# Altium schematic sheet SUP_2.5_FMC.SchDoc: AMC FMC Carrier v4
size A4; CompanyName: WUT; Organization: WUT ISE; Address1: Warsaw University of Technology; Address2: Nowowiejska 15/19 00-665 Warsaw; Address3: t.przywozki@gmail.com; Revision: 1; SheetNumber: 15; SheetTotal: 29; Project: AMC FMC Carrier v4.0.2; ModifiedBy: F. Świtakowski; CreateDate: XX/XX/XXXX; CheckedDate: -; Title2: Power FMCs PVADJ; DivGrp: ISE; Designer: T. Przywozki; ModifiedDate: -; ProjectName: ADC/DAC MEZZANINE
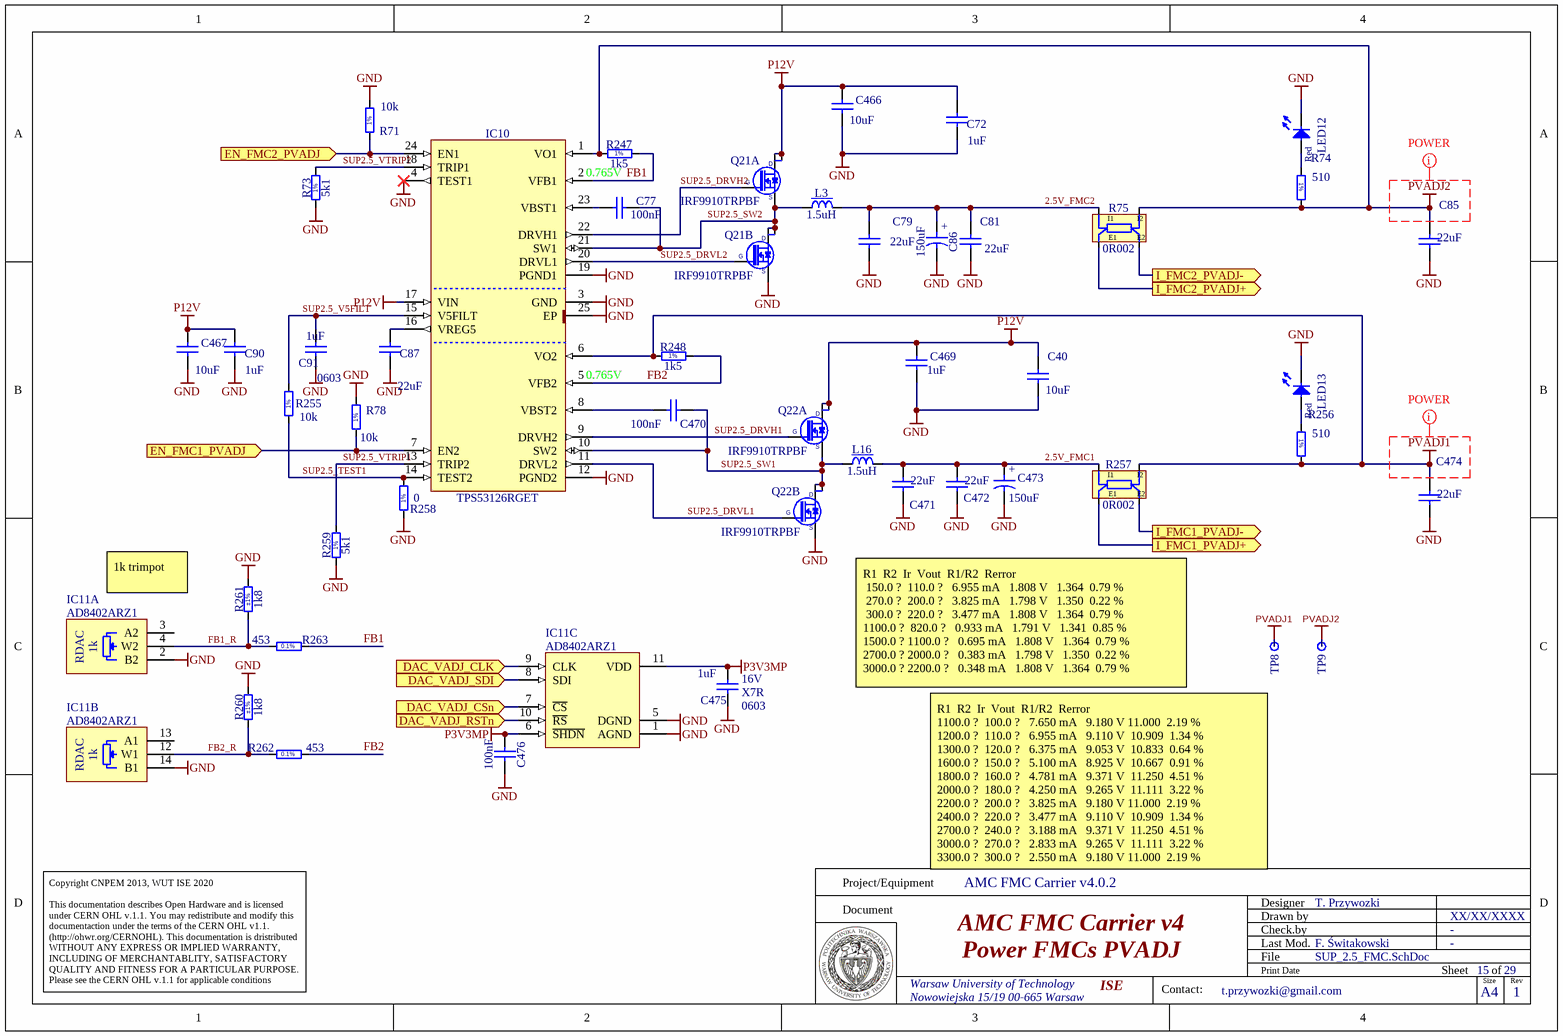
[diagram p0: SUP_2.5_FMC.SchDoc]

## Parts
C40  10uF  [CAPC2012X135N]
C72  1uF  [CAPC1608X87N]
C77  100nF  [CAPC1005X55N]
C79  22uF  [CAPC3216X180N]
C81  22uF  [CAPC3216X180N]
C85  22uF  [CAPC3216X180N]
C86  150uF  [CAPMP7343X200N]
C87  22uF  [CAPC3216X180N]
C90  1uF  [CAPC1608X87N]
C91  1uF  Case: 0603  [CAPC1608X87N]
C466  10uF  [CAPC2012X135N]
C467  10uF  [CAPC2012X135N]
C469  1uF  [CAPC1608X87N]
C470  100nF  [CAPC1005X55N]
C471  22uF  [CAPC3216X180N]
C472  22uF  [CAPC3216X180N]
C473  150uF  [CAPMP7343X200N]
C474  22uF  [CAPC3216X180N]
C475  1uF  Voltage: 16V  TC: X7R  Case: 0603  [CAPC1608X87N]
C476  100nF  [CAPC0603X33N]
IC10  TPS53126RGET  [QFN50P400X400X100-25N-S255]
IC11  AD8402ARZ1  [SOIC127P600X175-14N]  (parts A,B,C of 3)
L3  1.5uH  [IND_TDK_SPM6530]
L16  1.5uH  [IND_TDK_SPM6530]
LED12  Red  [LED_KINGBRIGHT_KPH-1608SURCK]
LED13  Red  [LED_KINGBRIGHT_KPH-1608SURCK]
Q21  IRF9910TRPBF  [SOIC127P600X175-8N]  (parts A,B of 2)
Q22  IRF9910TRPBF  [SOIC127P600X175-8N]  (parts A,B of 2)
R71  10k  [RESC1005X40N]
R73  5k1  [RESC1608X55N]
R74  510  [RESC1005X40N]
R75  0R002  [RES_VISHAY_WSK2512_0R005-0R2]
R78  10k  [RESC1005X40N]
R247  1k5  [RESC1608X55N]
R248  1k5  [RESC1608X55N]
R255  10k  [RESC1005X40N]
R256  510  [RESC1005X40N]
R257  0R002  [RES_VISHAY_WSK2512_0R005-0R2]
R258  0  [RESC1005X40N]
R259  5k1  [RESC1608X55N]
R260  1k8  Tolerance: ±1%  [RESC1608X55N]
R261  1k8  Tolerance: ±1%  [RESC1608X55N]
R262  453  [RESC1608X55N]
R263  453  [RESC1608X55N]
TP8  Test Point  [TPS127]  (value not drawn)  (no BOM)
TP9  Test Point  [TPS127]  (value not drawn)  (no BOM)

## Ports
DAC_VADJ_CLK (in), DAC_VADJ_CSn (in), DAC_VADJ_RSTn (in), DAC_VADJ_SDI (in), EN_FMC1_PVADJ (in), EN_FMC2_PVADJ (in), I_FMC1_PVADJ+ (out), I_FMC1_PVADJ- (out), I_FMC2_PVADJ+ (out), I_FMC2_PVADJ- (out)

## Nets
GND: C40.1 C72.1 C79.2 C81.2 C85.2 C86.2 C87.1 C90.1 C91.1 C466.1 C467.1 C469.1 C471.2 C472.2 C473.2 C474.2 C475.1 C476.2 IC10.3(GND) IC10.4(TEST1) IC10.12(PGND2) IC10.19(PGND1) IC10.25(EP) IC11.1(AGND) IC11.2(B2) IC11.5(DGND) IC11.14(B1) LED12.1(C) LED13.1(C) Q21.1(S) Q22.1(S) R71.2 R73.1 R78.2 R258.1 R259.1 R260.2 R261.2
P3V3MP: C475.2 C476.1 IC11.6(~{SHDN}) IC11.11(VDD)
P12V: C40.2 C72.2 C90.2 C466.2 C467.2 C469.2 IC10.17(VIN) Q21.5(D) Q21.6(D) Q22.5(D) Q22.6(D)
PVADJ1: C474.1 IC10.6(VO2) R248.1 R256.2 R257.I2 TP8.1
PVADJ2: C85.1 IC10.1(VO1) R74.2 R75.I2 R247.1 TP9.1
2.5V_FMC1: C471.1 C472.1 C473.1 L16.2 R257.I1
2.5V_FMC2: C79.1 C81.1 C86.1 L3.2 R75.I1
DAC_VADJ_CLK: IC11.9(CLK) ; port DAC_VADJ_CLK
DAC_VADJ_CSn: IC11.7(~{CS}) ; port DAC_VADJ_CSn
DAC_VADJ_RSTn: IC11.10(~{RS}) ; port DAC_VADJ_RSTn
DAC_VADJ_SDI: IC11.8(SDI) ; port DAC_VADJ_SDI
EN_FMC1_PVADJ: IC10.7(EN2) R78.1 ; port EN_FMC1_PVADJ
EN_FMC2_PVADJ: IC10.24(EN1) R71.1 ; port EN_FMC2_PVADJ
FB1: IC10.2(VFB1) R247.2 R263.1
FB1_R: IC11.4(W2) R261.1 R263.2
FB2: IC10.5(VFB2) R248.2 R262.2
FB2_R: IC11.12(W1) R260.1 R262.1
I_FMC1_PVADJ+: R257.E1 ; port I_FMC1_PVADJ+
I_FMC1_PVADJ-: R257.E2 ; port I_FMC1_PVADJ-
I_FMC2_PVADJ+: R75.E1 ; port I_FMC2_PVADJ+
I_FMC2_PVADJ-: R75.E2 ; port I_FMC2_PVADJ-
SUP2.5_DRVH1: IC10.9(DRVH2) Q22.4(G)
SUP2.5_DRVH2: IC10.22(DRVH1) Q21.4(G)
SUP2.5_DRVL1: IC10.11(DRVL2) Q22.2(G)
SUP2.5_DRVL2: IC10.20(DRVL1) Q21.2(G)
SUP2.5_SW1: C470.1 IC10.10(SW2) L16.1 Q22.3(S) Q22.7(D) Q22.8(D)
SUP2.5_SW2: C77.1 IC10.21(SW1) L3.1 Q21.3(S) Q21.7(D) Q21.8(D)
SUP2.5_TEST1: IC10.14(TEST2) R255.1 R258.2
SUP2.5_V5FILT: C91.2 IC10.15(V5FILT) R255.2
SUP2.5_VTRIP1: IC10.13(TRIP2) R259.2
SUP2.5_VTRIP2: IC10.18(TRIP1) R73.2
NetC77_2: C77.2 IC10.23(VBST1)
NetC87_2: C87.2 IC10.16(VREG5)
NetC470_2: C470.2 IC10.8(VBST2)
NetLED12_2: LED12.2(A) R74.1
NetLED13_2: LED13.2(A) R256.1

Not connected (* = marked no-connect by the designer): IC11 3(A2) 13(A1)

## Layout directives
net class POWER: PVADJ1, PVADJ2

## Notes on the sheet
- 0.765V
- (near IC10) 0.765V
- 1k trimpot
- R1 	R2 	Ir 	Vout 	R1/R2 	Rerror
  150.0 ?	 110.0 ?	  6.955 mA	  1.808 V	  1.364	 0.79 %
  270.0 ?	 200.0 ?	  3.825 mA	  1.798 V	  1.350	 0.22 %
  300.0 ?	 220.0 ?	  3.477 mA	  1.808 V	  1.364	 0.79 %
  1100.0 ?	 820.0 ?	  0.933 mA	  1.791 V	  1.341	 0.85 %
  1500.0 ?	1100.0 ?	  0.695 mA	  1.808 V	  1.364	 0.79 %
  2700.0 ?	2000.0 ?	  0.383 mA	  1.798 V	  1.350	 0.22 %
  3000.0 ?	2200.0 ?	  0.348 mA	  1.808 V	  1.364	 0.79 %
- R1 	R2 	Ir 	Vout 	R1/R2 	Rerror
  1100.0 ?	 100.0 ?	  7.650 mA	  9.180 V	11.000	 2.19 %
  1200.0 ?	 110.0 ?	  6.955 mA	  9.110 V	 10.909	 1.34 %
  1300.0 ?	 120.0 ?	  6.375 mA	  9.053 V	 10.833	 0.64 %
  1600.0 ?	 150.0 ?	  5.100 mA	  8.925 V	 10.667	 0.91 %
  1800.0 ?	 160.0 ?	  4.781 mA	  9.371 V	 11.250	 4.51 %
  2000.0 ?	 180.0 ?	  4.250 mA	  9.265 V	 11.111	 3.22 %
  2200.0 ?	 200.0 ?	  3.825 mA	  9.180 V	11.000	 2.19 %
  2400.0 ?	 220.0 ?	  3.477 mA	  9.110 V	 10.909	 1.34 %
  2700.0 ?	 240.0 ?	  3.188 mA	  9.371 V	 11.250	 4.51 %
  3000.0 ?	 270.0 ?	  2.833 mA	  9.265 V	 11.111	 3.22 %
  3300.0 ?	 300.0 ?	  2.550 mA	  9.180 V	11.000	 2.19 %
- Project/Equipment
- Document
- Designer
- Drawn by
- Check.by
- Copyright CNPEM 2013, WUT ISE 2020
  This documentation describes Open Hardware and is licensed under CERN OHL v.1.1. You may redistribute and modify this documentaction under the terms of the CERN OHL v1.1.
  (http://ohwr.org/CERNOHL). This documentation is dristributed WITHOUT ANY EXPRESS OR IMPLIED WARRANTY, INCLUDING OF MERCHANTABLITY, SATISFACTORY QUALITY AND FITNESS FOR A PARTICULAR PURPOSE. Please see the CERN OHL v.1.1 for applicable conditions
- File
- Last Mod.
- Print Date
- Sheet
- Size
- A4
- of
- Rev
- Contact:
- (in symbol AD8402ARZ1, part A) RDAC; 1k
- (in symbol AD8402ARZ1, part B) RDAC; 1k
- (in symbol CAEM7343-20_150UF_4V_20%_LESR0016) +
- (in symbol R0402_0R_JUMPER) 1%
- (in symbol R0402_10K_1%_0.0625W_100PPM) 1%
- (in symbol R0402_510R_1%_0.0625W_100PPM) 1%
- (in symbol R0603_1K5_1%_0.1W_100PPM) 1%
- (in symbol R0603_5K1_1%_0.1W_100PPM) 1%
- (in symbol R0603_453R_0.1%_0.063W_10PPM) 0.1%

## Library data of the parts
C40 C466 C467 = CC0805_10UF_16V_10%_X5R: Non-polarised capacitor; Part Description: SMD Multilayer Chip Ceramic Capacitor; Manufacturer: GENERIC; Manufacturer1 Part Number: C0805C106K4PAC; Voltage: 16V; TC: X5R; Tolerance: ±10%; Table: Capacitors SMD; Part Number: CC0805_10UF_16V_10%_X5R; Component Kind: Standard; Component Type: Standard; Pin Count: 2; Value: 10uF; Status: Preferred; Manufacturer Part Number: CC0805_10UF_16V_10%_X5R; Case: 0805; Mounted: Yes; Socket: No; SMD: Yes; Manufacturer1 Example: KEMET; Manufacturer1 ComponentHeight: 1.4mm; HelpURL: \\cern.ch\dfs\Applications\Altium\Datasheets\CC1206_X5R_KEMET.pdf; Author: CERN DEM JLC; CreateDate: 2007-12-03; LatestRevisionDate: 2007-12-03
C72 C90 C91 C469 = CC0603_1UF_16V_10%_X7R: Non-polarised capacitor; Part Description: SMD Multilayer Chip Ceramic Capacitor; Manufacturer: GENERIC; Manufacturer1 Part Number: 223824613663; Voltage: 16V; TC: X7R; Tolerance: ±10%; Table: Capacitors SMD; Part Number: CC0603_1UF_16V_10%_X7R; Component Kind: Standard; Component Type: Standard; Pin Count: 2; Value: 1uF; Status: Preferred; Manufacturer Part Number: CC0603_1uF_16V_10%_X7R; Mounted: Yes; Socket: No; SMD: Yes; Manufacturer1 Example: PHYCOMP; Manufacturer1 ComponentHeight: 0.87mm; HelpURL: \\cern.ch\dfs\Applications\Altium\Datasheets\CC0805_X5R_PHYCOMP_HC.pdf; Author: CERN DEM JLC
  C72 C90 C469: Case: 0603; CreateDate: 2007-12-03; LatestRevisionDate: 2007-12-03
  C91: CreateDate: 03/12/2007; LatestRevisionDate: 03/12/2007
C77 C470 = CC0402_100NF_16V_10%_X7R: Non-polarised capacitor; Part Description: SMD Multilayer Chip Ceramic Capacitor; Manufacturer: GENERIC; Manufacturer1 Part Number: 223878715649; Voltage: 16V; TC: X7R; Tolerance: ±10%; Table: Capacitors SMD; Part Number: CC0402_100NF_16V_10%_X7R; Component Kind: Standard; Component Type: Standard; Pin Count: 2; Value: 100nF; Status: Not Recommended; Manufacturer Part Number: CC0402_100NF_16V_10%_X7R; Case: 0402; Mounted: Yes; Socket: No; SMD: Yes; Manufacturer1 Example: PHYCOMP; Manufacturer1 ComponentHeight: 0.55mm; HelpURL: \\cern.ch\dfs\Applications\Altium\Datasheets\CC0402_X7R_PHYCOMP.pdf; Author: CERN DEM JLC; CreateDate: 2007-12-03; LatestRevisionDate: 2007-12-03
C79 C81 C85 C87 C471 C472 C474 = CC1206_22UF_10V_10%_X7R: Non-polarised capacitor; Part Description: SMD Multilayer Chip Ceramic Capacitor; Manufacturer: GENERIC; Manufacturer1 Part Number: GRM31CR71A226KE15L; Voltage: 10V; TC: X7R; Tolerance: ±10%; Table: Capacitors SMD; Part Number: CC1206_22UF_10V_10%_X7R; Component Kind: Standard; Component Type: Standard; Pin Count: 2; Value: 22uF; Status: Preferred; Manufacturer Part Number: CC1206_22UF_10V_10%_X7R; Case: 1206; Mounted: Yes; Socket: No; SMD: Yes; Manufacturer1 Example: MURATA; Manufacturer1 ComponentHeight: 1.8mm; HelpURL: \\cern.ch\dfs\Applications\Altium\Datasheets\CC1206_X7R_MURATA_GRM-HI-CAP.pdf; Author: CERN DEM JLC; CreateDate: 2010-06-08; LatestRevisionDate: 2010-06-08
C86 C473 = CAEM7343-20_150UF_4V_20%_LESR0016: Polarised capacitor; Part Description: ESR 0R016 Polymer Aluminum Electrolytic Capacitor; Manufacturer: MURATA; Manufacturer Part Number: ECASD40G157M016K00; Voltage: 4V; Tolerance: ±20%; Part Number: CAEM7343-20_150UF_4V_20%_LESR0016; Component Kind: Standard; Component Type: Standard; Pin Count: 2; Value: 150uF; Status: None; Mounted: Yes; Socket: No; SMD: Yes; Sense: No; ComponentHeight: 2mm; HelpURL: \\cern.ch\dfs\Applications\Altium\Datasheets\CAEM_MURATA_ECAS.pdf; Author: CERN DEM JLC; CreateDate: 11.01.2012; LatestRevisionDate: 11.01.2012
C475 = CC0603_1UF_16V_10%_X7R: Non-polarised capacitor; Part Description: SMD Multilayer Chip Ceramic Capacitor; Manufacturer: GENERIC; Manufacturer1 Part Number: 223824613663; Tolerance: ±10%; Table: Capacitors SMD; Part Number: CC0603_1UF_16V_10%_X7R; Component Kind: Standard; Component Type: Standard; Pin Count: 2; Value: 1uF; Status: Preferred; Manufacturer Part Number: CC0603_1uF_16V_10%_X7R; Mounted: Yes; Socket: No; SMD: Yes; Manufacturer1 Example: PHYCOMP; Manufacturer1 ComponentHeight: 0.87mm; HelpURL: \\cern.ch\dfs\Applications\Altium\Datasheets\CC0805_X5R_PHYCOMP_HC.pdf; Author: CERN DEM JLC; CreateDate: 12/3/2007; LatestRevisionDate: 12/3/2007
C476 = CC0201_100NF_6.3V_10%_X5R: Non-polarised capacitor; Part Description: SMD Multilayer Chip Ceramic Capacitor; Manufacturer: GENERIC; Manufacturer1 Part Number: 02016D104KAT2A; Voltage: 6.3V; TC: X5R; Tolerance: ±10%; Table: Capacitors SMD; Part Number: CC0201_100NF_6.3V_10%_X5R; Component Kind: Standard; Component Type: Standard; Pin Count: 2; Value: 100nF; Status: Not Recommended; Manufacturer Part Number: CC0201_100NF_6.3V_10%_X5R; Case: 0201; Mounted: Yes; Socket: No; SMD: Yes; Manufacturer1 Example: AVX; Manufacturer1 ComponentHeight: 0.33mm; HelpURL: \\cern.ch\dfs\Applications\Altium\Datasheets\CC0201_X5R_AVX.pdf; Author: CERN DEM JLC; CreateDate: 2007-12-03; LatestRevisionDate: 2007-12-03
IC10 = TPS53126RGET: Dual Synchronous Step-Down Controller For Low Voltage Power Rails; Manufacturer: TEXAS INSTRUMENTS; Table: Analog & Interface; Part Number: TPS53126RGET; Component Kind: Standard; Component Type: Standard; Device: TPS53126RGET; PackageDescription: QFN,0.50mm pitch,square;6 pin X 6 pin,4.15mm X 4.15mm X 1.00mm H body (w/thermal tab 2.55 X 2.55mm),  IPC Medium Density; Part Description: Dual Synchronous Step-Down Controller For Low Voltage Power Rails; Manufacturer Part Number: TPS53126RGET; Pin Count: 25; Case: QFN24; Mounted: Yes; Socket: No; SMD: Yes; ComponentHeight: 1.0mm; Author: CERN DEM JLC; HelpURL: \\cern.ch\dfs\Applications\Altium\Datasheets\TPS53126RGET.pdf; CreateDate: 2010-08-26; LatestRevisionDate: 2010-08-26
IC11 = AD8402ARZ1: 2-Channel 1k Digital Potentiometer; Manufacturer: ANALOG DEVICES; PressFit: No; Bonding: No; Part Number: AD8402ARZ1; Component Kind: Standard; Component Type: Standard; Device: AD8402ARZ1; PackageDescription: SOIC 14, Pitch 1.27mm - Body 4x8.75mm, IPC Medium Density; Part Description: 2-Channel 1k Digital Potentiometer; Manufacturer Part Number: AD8402ARZ1; Pin Count: 14; Case: SOIC14; Mounted: Yes; Socket: No; SMD: Yes; Sense: No; ComponentHeight: 1.75mm; Author: CERN DEM JLC; HelpURL: \\cern.ch\dfs\Applications\Altium\Datasheets\AD8402ARZ1.pdf; CreateDate: 09.11.2016; LatestRevisionDate: 09.11.2016
L3 L16 = IND_1.5UH_20%_TDK_SPM6530: Inductor With Core; Part Description: SMD Inductor for Power Circuits (Wound Metal), SPM Series; Manufacturer: TDK; Manufacturer Part Number: SPM6530T-1R5M100; Power: 11A; Resistance: 0.0097R; Tolerance: ±20%; Part Number: IND_1.5UH_20%_TDK_SPM6530; Component Kind: Standard; Component Type: Standard; Pin Count: 2; Value: 1.5uH; Status: None; Mounted: Yes; Socket: No; SMD: Yes; Sense: No; ComponentHeight: 3mm; HelpURL: \\cern.ch\dfs\Applications\Altium\Datasheets\IND_TDK_SPM6530.pdf; Author: CERN DEM MR; CreateDate: 08.11.2016; LatestRevisionDate: 08.11.2016
LED12 LED13 = LED_KINGBRIGHT_KPH-1608SURCK: LED Red 1C 2A; Part Description: SMD Hyper Red LED, Case 1.6mmX0.8mm(0603), 0.65mm Thickness; PressFit: No; Bonding: No; Part Number: LED_KINGBRIGHT_KPH-1608SURCK; Component Kind: Standard; Component Type: Standard; Color: Red; PackageDescription: SMT Hyper Red LED, Case 0603, Body L 1.6 x W 0.8mm H 0.65mm; Manufacturer: KINGBRIGHT; Manufacturer Part Number: KPH-1608SURCK; Pin Count: 2; Mounted: Yes; Socket: No; SMD: Yes; Sense: No; ComponentHeight: 0.65mm; HelpURL: \\cern.ch\dfs\Applications\Altium\Datasheets\LED_KINGBRIGHT_KPH-1608SURCK.pdf; Author: CERN DEM JLC; CreateDate: 03.07.2017; LatestRevisionDate: 03.07.2017
Q21 Q22 = IRF9910TRPBF: Dual SO-8 MOSFET For POL Cconverter; Part Description: 20V 10A(Q1) 20V 12A (Q2) Dual SO-8 MOSFET For POL Cconverter; Manufacturer: INTERNATIONAL RECTIFIER; Table: Transistors; Part Number: IRF9910TRPBF; Component Kind: Standard; Component Type: Standard; Device: IRF9910TRPBF; PackageDescription: SOIC 8, Pitch 1.27mm - Body 4x5mm, IPC Medium Density; Manufacturer Part Number: IRF9910TRPBF; Pin Count: 8; Case: SO8; Mounted: Yes; Socket: No; SMD: Yes; ComponentHeight: 1.75mm; HelpURL: \\cern.ch\dfs\Applications\Altium\Datasheets\IRF9910Pbf.pdf; Author: TP; CreateDate: 11.12.2020
R71 R78 R255 = R0402_10K_1%_0.0625W_100PPM: Resistor - 1%; Part Description: General Purpose Thick Film Chip Resistor; Manufacturer: GENERIC; Manufacturer1 Part Number: 232270671003L; TC: ±100ppm/°C; Table: Resistors SMD; Part Number: R0402_10K_1%_0.0625W_100PPM; Component Kind: Standard; Component Type: Standard; Pin Count: 2; Value: 10k; Status: Not recommended; Power: 0.0625W; Tolerance: ±1%; Manufacturer Part Number: R0402_10K_1%_0.0625W_100PPM; Case: 0402; Mounted: Yes; Socket: No; SMD: Yes; Manufacturer1 Example: YAGEO PHYCOMP; Manufacturer1 ComponentHeight: 0.4mm; HelpURL: \\cern.ch\dfs\Applications\Altium\Datasheets\R0402_Phycomp_RC0402.pdf; Author: CERN DEM JLC; CreateDate: 2007-12-03; LatestRevisionDate: 2012-10-17
R73 R259 = R0603_5K1_1%_0.1W_100PPM: Resistor - 1%; Part Description: General Purpose Thick Film Chip Resistor; Manufacturer: GENERIC; Manufacturer1 Part Number: NRC06F5101TRF; Power: 0.1W; TC: ±100ppm/°C; Table: Resistors SMD; Part Number: R0603_5K1_1%_0.1W_100PPM; Component Kind: Standard; Component Type: Standard; Pin Count: 2; Value: 5k1; Status: Preferred; Tolerance: ±1%; Manufacturer Part Number: R0603_5K1_1%_0.1W_100PPM; Case: 0603; Mounted: Yes; Socket: No; SMD: Yes; Manufacturer1 Example: NIC COMPONENT; Manufacturer1 ComponentHeight: 0.55mm; HelpURL: \\cern.ch\dfs\Applications\Altium\Datasheets\R0603_NIC_NRC.pdf; Author: CERN DEM JLC; CreateDate: 2007-12-03; LatestRevisionDate: 2008-03-13
R74 R256 = R0402_510R_1%_0.0625W_100PPM: Resistor - 1%; Part Description: General Purpose Thick Film Chip Resistor; Manufacturer: GENERIC; Manufacturer1 Part Number: 232270675101L; TC: ±100ppm/°C; Table: Resistors SMD; Part Number: R0402_510R_1%_0.0625W_100PPM; Component Kind: Standard; Component Type: Standard; Pin Count: 2; Value: 510; Status: Not recommended; Power: 0.0625W; Tolerance: ±1%; Manufacturer Part Number: R0402_510R_1%_0.0625W_100PPM; Case: 0402; Mounted: Yes; Socket: No; SMD: Yes; Manufacturer1 Example: YAGEO PHYCOMP; Manufacturer1 ComponentHeight: 0.4mm; HelpURL: \\cern.ch\dfs\Applications\Altium\Datasheets\R0402_Phycomp_RC0402.pdf; Author: CERN DEM JLC; CreateDate: 2007-12-03; LatestRevisionDate: 2012-10-17
R75 R257 = R2512_0R002_1%_1W_35PPM_VISHAY_WSK: Power and Current Sensing Resistor; Part Description: Power Metal Strip® Resistor, Low Value; Manufacturer: VISHAY DALE; Manufacturer Part Number: WSK25122L000FEA; Power: 1W; TC: ±35ppm/°C; Tolerance: ±1%; PressFit: No; Part Number: R2512_0R002_1%_1W_35PPM_VISHAY_WSK; Component Kind: Standard; Component Type: Standard; Pin Count: 4; Value: 0R002; Status: None; Case: 2512; Mounted: Yes; Sense: No; Socket: No; SMD: Yes; ComponentHeight: 0.89mm; HelpURL: \\cern.ch\dfs\Applications\Altium\Datasheets\R2512_VISHAY_WSK.pdf; Author: CERN DEM MR; CreateDate: 08.11.2016; LatestRevisionDate: 19.02.2018
R247 R248 = R0603_1K5_1%_0.1W_100PPM: Resistor - 1%; Part Description: General Purpose Thick Film Chip Resistor; Manufacturer: GENERIC; Manufacturer1 Part Number: NRC06F1501TRF; Power: 0.1W; TC: ±100ppm/°C; Table: Resistors SMD; Part Number: R0603_1K5_1%_0.1W_100PPM; Component Kind: Standard; Component Type: Standard; Pin Count: 2; Value: 1k5; Status: Preferred; Tolerance: ±1%; Manufacturer Part Number: R0603_1K5_1%_0.1W_100PPM; Case: 0603; Mounted: Yes; Socket: No; SMD: Yes; Manufacturer1 Example: NIC COMPONENT; Manufacturer1 ComponentHeight: 0.55mm; HelpURL: \\cern.ch\dfs\Applications\Altium\Datasheets\R0603_NIC_NRC.pdf; Author: CERN DEM JLC; CreateDate: 2007-12-03; LatestRevisionDate: 2008-03-13
R258 = R0402_0R_JUMPER: Resistor - 1%; Part Description: 1A (0.05R Max DC Resistance) Zero Ohm Jumper; Manufacturer: GENERIC; Manufacturer1 Part Number: 232270591001L; Table: Resistors SMD; Part Number: R0402_0R_JUMPER; Component Kind: Standard; Component Type: Standard; Pin Count: 2; Value: 0; Status: Not recommended; Manufacturer Part Number: R0402_0R_JUMPER; Case: 0402; Mounted: Yes; Socket: No; SMD: Yes; Manufacturer1 Example: YAGEO PHYCOMP; Manufacturer1 ComponentHeight: 0.4mm; HelpURL: \\cern.ch\dfs\Applications\Altium\Datasheets\R0402_Phycomp_RC0402.pdf; Author: CERN DEM JLC; CreateDate: 2007-12-03; LatestRevisionDate: 2012-10-17
R260 R261 = R0603_1K8_1%_0.1W_100PPM: Resistor - 1%; Part Description: General Purpose Thick Film Chip Resistor; Manufacturer: GENERIC; Manufacturer1 Part Number: NRC06F1801TRF; Power: 0.1W; TC: ±100ppm/°C; PressFit: No; Part Number: R0603_1K8_1%_0.1W_100PPM; Component Kind: Standard; Component Type: Standard; Pin Count: 2; Value: 1k8; Status: Preferred; Manufacturer Part Number: R0603_1K8_1%_0.1W_100PPM; Case: 0603; Mounted: Yes; Sense: No; Socket: No; SMD: Yes; Manufacturer1 Example: NIC COMPONENT; Manufacturer1 ComponentHeight: 0.55mm; HelpURL: \\cern.ch\dfs\Applications\Altium\Datasheets\R0603_NIC_NRC.pdf; Author: CERN DEM JLC; CreateDate: 03.12.2007; LatestRevisionDate: 13.03.2008
R262 R263 = R0603_453R_0.1%_0.063W_10PPM: Resistor - 0.1%; Part Description: Thin Film Chip Resistor; Manufacturer: GENERIC; Manufacturer1 Part Number: RN73C1J453RBTDF; Power: 0.063W; TC: ±10ppm; Table: Resistors SMD; Part Number: R0603_453R_0.1%_0.063W_10PPM; Component Kind: Standard; Component Type: Standard; Pin Count: 2; Value: 453; Status: Not recommended; Tolerance: ±0.1%; Manufacturer Part Number: R0603_453R_0.1%_0.063W_10PPM; Case: 0603; Mounted: Yes; Socket: No; SMD: Yes; Manufacturer1 Example: TYCO HOLSWORTHY; Manufacturer1 ComponentHeight: 0.5mm; HelpURL: \\cern.ch\dfs\Applications\Altium\Datasheets\R0603_Tyco_RN73.pdf; Author: CERN DEM JLC; CreateDate: 2007-12-03; LatestRevisionDate: 2008-03-13
TP8 TP9 = SMD_PAD_1.27X1.27MM: Part Description: 1.27mm x 1.27mm PCB Copper Area (SMD Test Point); Mounted: No; Part Number: SMD_PAD_1.27X1.27MM; Component Type: Standard (No BOM); Pin Count: 1; Family: Test Point; Socket: No; SMD: Yes; Sense: No; Status: None; ComponentHeight: 0mm; HelpURL: Undefined; Author: CERN DEM JLC; CreateDate: 12.01.2008; LatestRevisionDate: 12.01.2008; PackageDescription: 1.27mm x 1.27mm PCB Copper Area (SMD Test Point)